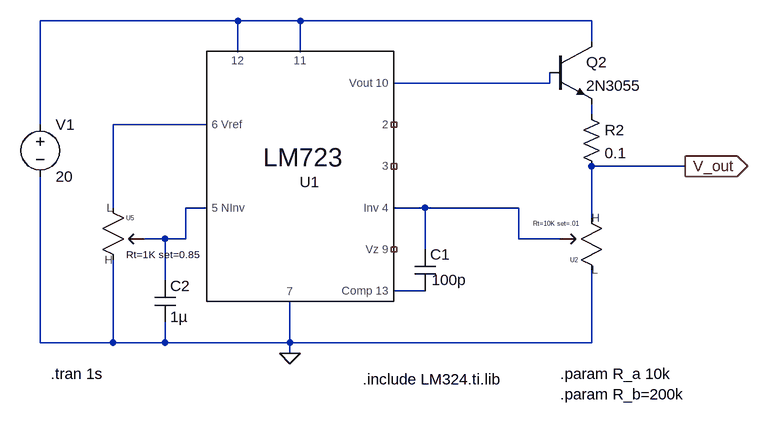
[diagram p0: schematic LM723-study.asc]
LM723-study.asc, the LTspice schematic file:
Version 4.1
SHEET 1 2544 836
WIRE -128 -32 -432 -32
WIRE -32 -32 -128 -32
WIRE 416 -32 -32 -32
WIRE 416 0 416 -32
WIRE -128 16 -128 -32
WIRE -32 16 -32 -32
WIRE 352 64 352 48
WIRE 352 64 112 64
WIRE 416 112 416 96
WIRE -432 128 -432 -32
WIRE -176 128 -320 128
WIRE 560 192 416 192
WIRE -320 256 -320 128
WIRE -176 256 -208 256
WIRE 160 256 112 256
WIRE 304 256 160 256
WIRE 416 272 416 192
WIRE -240 304 -272 304
WIRE -208 304 -208 256
WIRE -208 304 -240 304
WIRE 304 304 304 256
WIRE 368 304 304 304
WIRE 160 320 160 256
WIRE -240 368 -240 304
WIRE 160 384 112 384
WIRE -432 464 -432 208
WIRE -320 464 -320 336
WIRE -320 464 -432 464
WIRE -240 464 -240 432
WIRE -240 464 -320 464
WIRE -48 464 -48 400
WIRE -48 464 -240 464
WIRE 416 464 416 352
WIRE 416 464 -48 464
WIRE -48 480 -48 464
FLAG -48 480 0
FLAG 560 192 V_out
IOPIN 560 192 Out
SYMBOL LM723 -32 80 R0
WINDOW 0 -1 136 Left 2
WINDOW 3 5 99 Center 4
SYMATTR InstName U1
SYMBOL voltage -432 112 R0
WINDOW 123 0 0 Left 0
WINDOW 39 0 0 Left 0
SYMATTR InstName V1
SYMATTR Value 20
SYMBOL npn 352 0 R0
SYMATTR InstName Q2
SYMATTR Value 2N3055
SYMBOL res 400 96 R0
SYMATTR InstName R2
SYMATTR Value 0.1
SYMBOL cap 144 320 R0
WINDOW 3 26 47 Left 2
SYMATTR Value 100p
SYMATTR InstName C1
SYMBOL cap -256 368 R0
SYMATTR InstName C2
SYMATTR Value 1µ
SYMBOL pot -336 240 R0
WINDOW 3 36 88 Left 1
SYMATTR Value Rt=1K set=0.85
SYMATTR InstName U5
SYMBOL pot 432 368 R180
SYMATTR InstName U2
SYMATTR Value Rt=10K set=.01
TEXT 368 512 Left 2 !.param R_a 10k\n.param R_b=200k
TEXT -416 512 Left 2 !.tran 1s
TEXT 64 520 Left 2 !.include LM324.ti.lib

The netlist it stands for:
* LM723-study.asc
X§U1 NC_01 NC_02 N006 N005 N004 0 NC_03 N002 N001 N001 N007 LM723  ; pins 2 3 Inv_4 5_NInv 6_Vref 7 Vz_9 Vout_10 11 12 Comp_13
V1 N001 0 20
Q2 N001 N002 N003 0 2N3055
R2 N003 V_out 0.1
C1 N006 N007 100p
C2 N005 0 1µ
X§U5 0 N004 N005 pot Rt=1K set=0.85  ; pins H L 3
X§U2 V_out 0 N006 pot Rt=10K set=.01  ; pins H L 3
.model NPN NPN
.model PNP PNP
.lib standard.bjt
.param R_a 10k
.param R_b=200k
.tran 1s
.include LM324.ti.lib
.lib Lm723.sub
.lib pot.lib
.backanno
.end